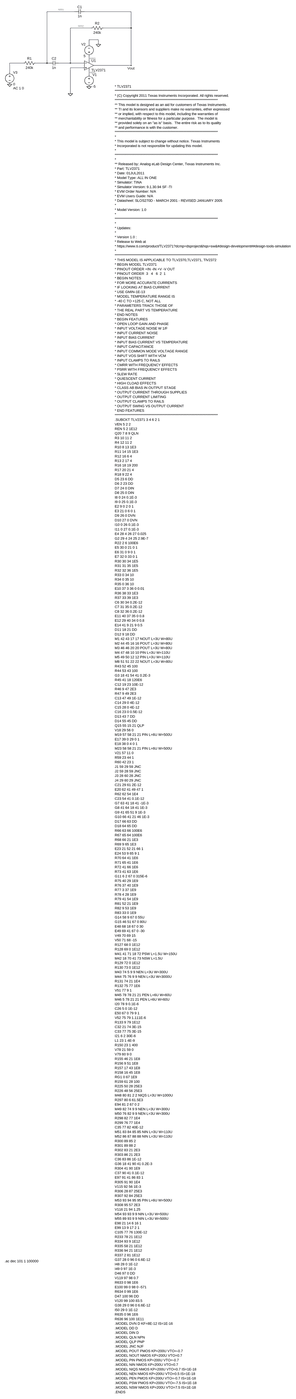
[diagram p0: schematic A.asc, whole sheet]
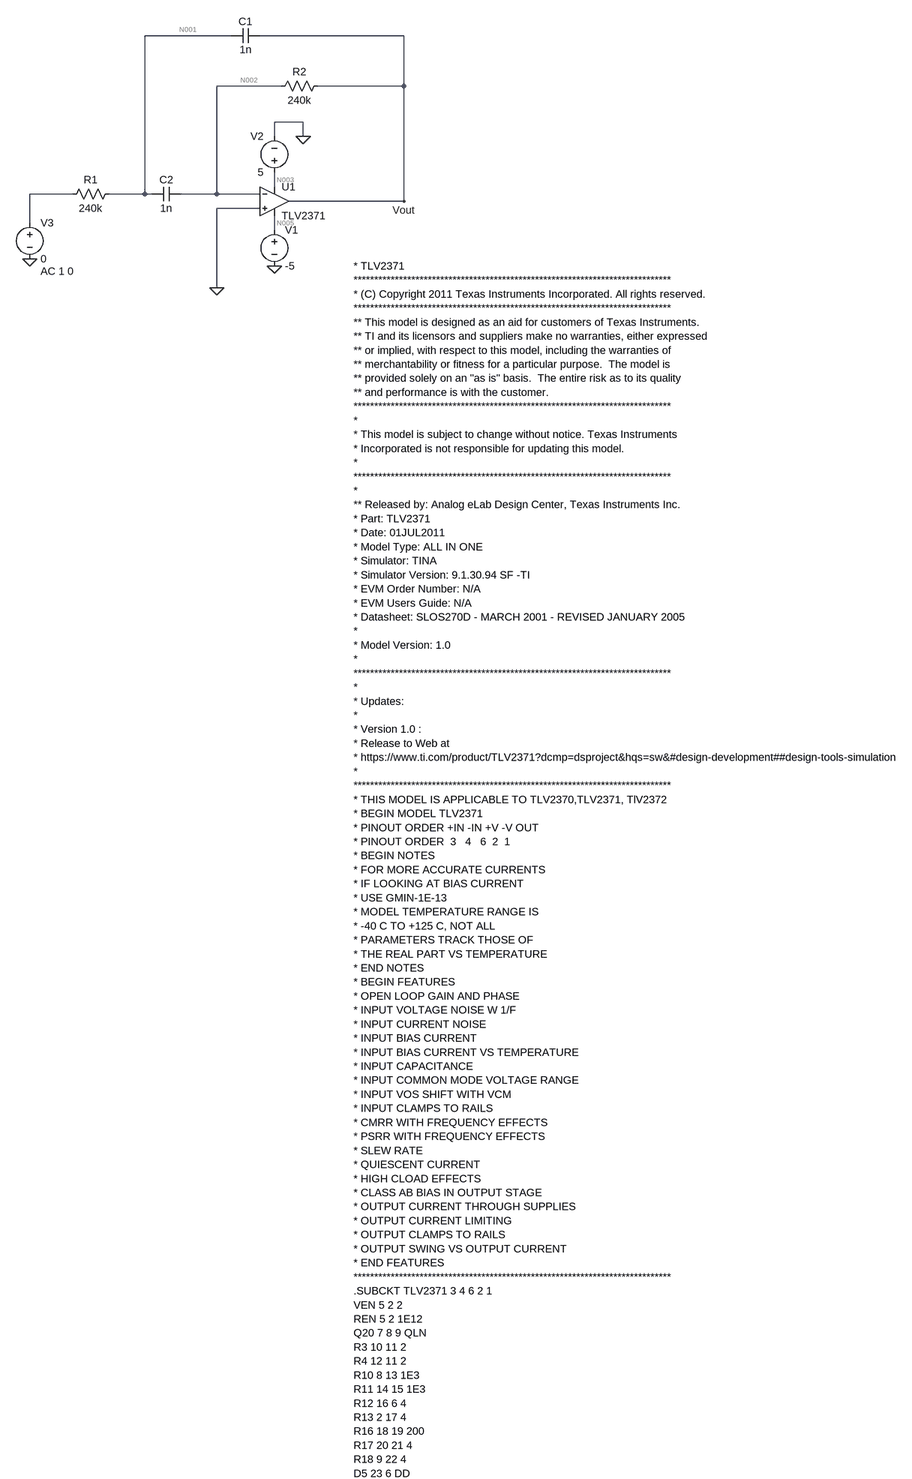
[diagram p1: schematic A.asc, part, row 1 of 3, column 1 of 1]
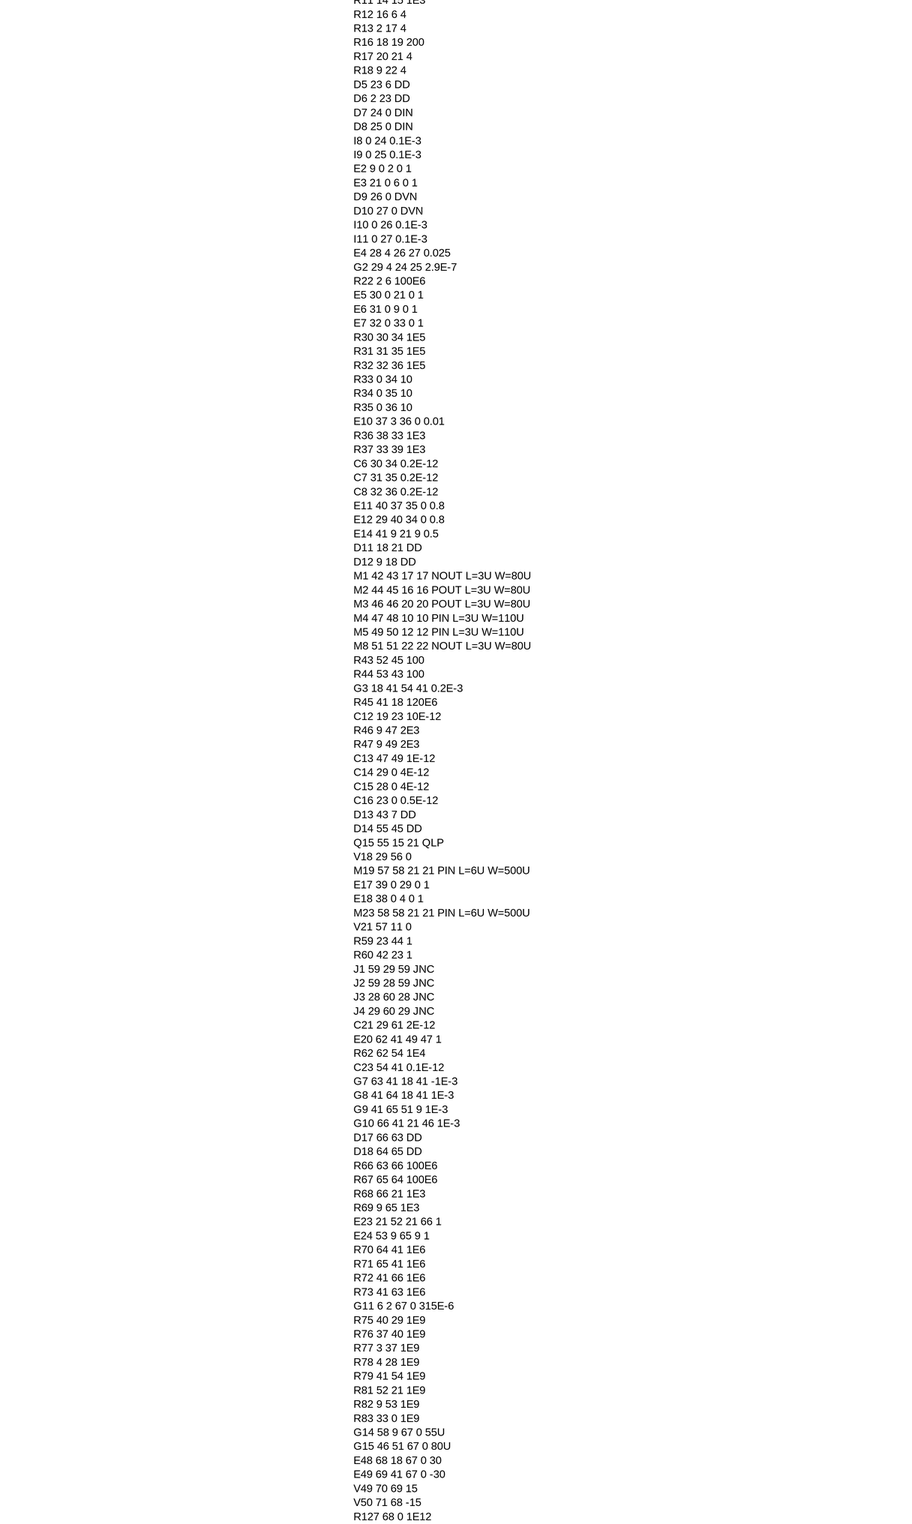
[diagram p2: schematic A.asc, part, row 2 of 3, column 1 of 1]
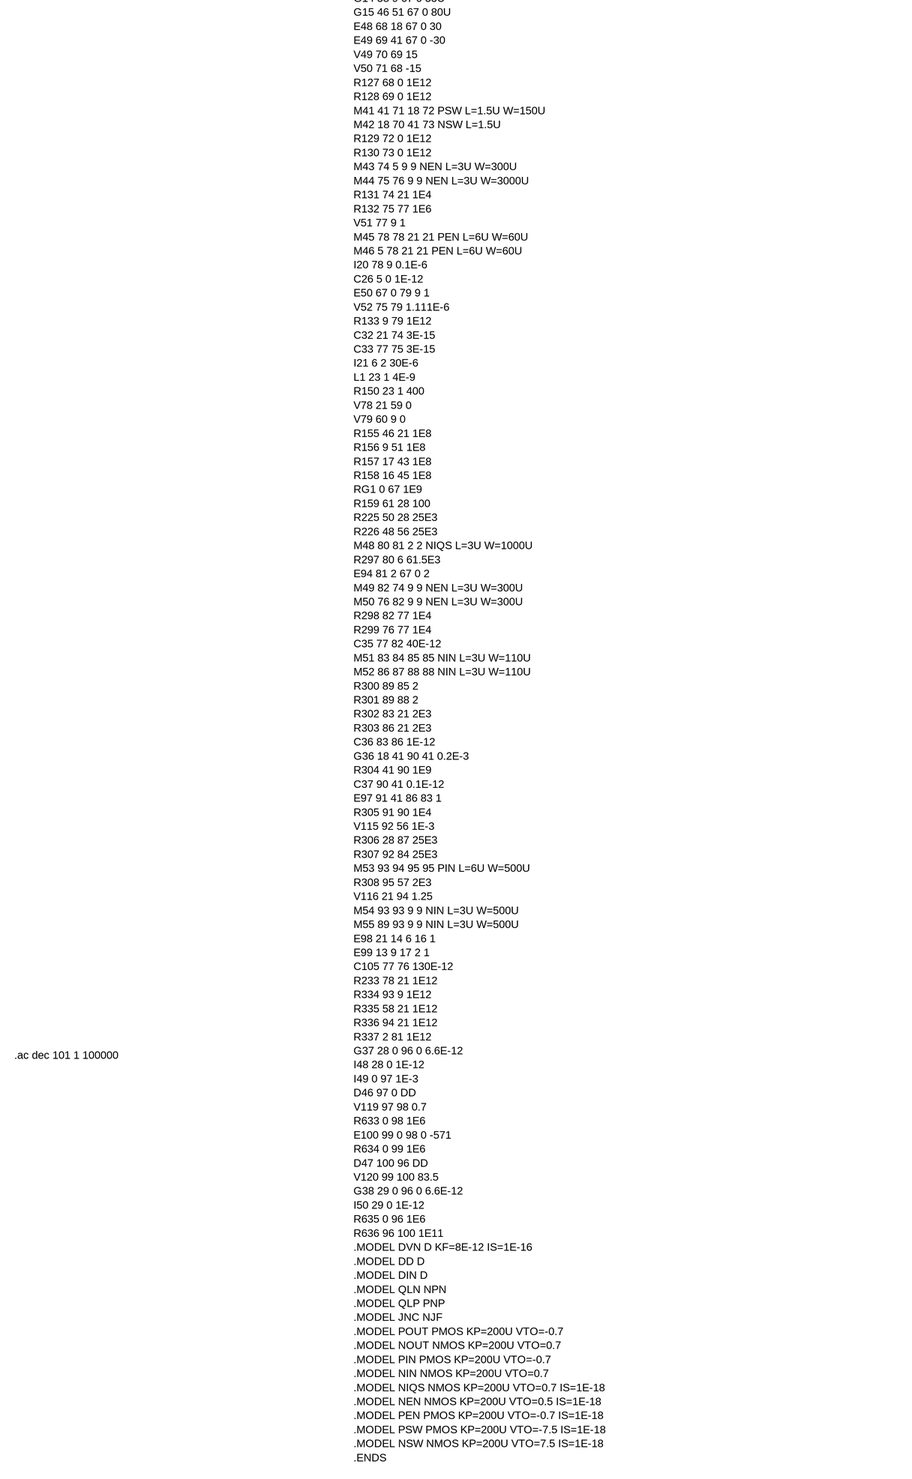
[diagram p3: schematic A.asc, part, row 3 of 3, column 1 of 1]
A.asc, the LTspice schematic file:
Version 4
SHEET 1 1760 8332
WIRE 112 -224 -80 -224
WIRE 496 -224 176 -224
WIRE 224 -112 80 -112
WIRE 496 -112 496 -224
WIRE 496 -112 304 -112
WIRE 272 -32 208 -32
WIRE 208 0 208 -32
WIRE 272 0 272 -32
WIRE 208 112 208 80
WIRE -240 128 -336 128
WIRE -80 128 -80 -224
WIRE -80 128 -160 128
WIRE -64 128 -80 128
WIRE 80 128 80 -112
WIRE 80 128 0 128
WIRE 176 128 80 128
WIRE 496 144 496 -112
WIRE 496 144 240 144
WIRE 176 160 80 160
WIRE -336 192 -336 128
WIRE 208 208 208 176
WIRE 80 336 80 160
FLAG 272 0 0
FLAG 208 288 0
FLAG 80 336 0
FLAG -336 272 0
FLAG 496 144 Vout
SYMBOL OpAmps\\opamp2 208 80 R0
SYMATTR InstName U1
SYMATTR Value TLV2371
SYMBOL res -144 112 R90
WINDOW 0 0 56 VBottom 2
WINDOW 3 32 56 VTop 2
SYMATTR InstName R1
SYMATTR Value 240k
SYMBOL cap 176 -240 R90
WINDOW 0 0 32 VBottom 2
WINDOW 3 32 32 VTop 2
SYMATTR InstName C1
SYMATTR Value 1n
SYMBOL cap 0 112 R90
WINDOW 0 0 32 VBottom 2
WINDOW 3 32 32 VTop 2
SYMATTR InstName C2
SYMATTR Value 1n
SYMBOL res 320 -128 R90
WINDOW 0 0 56 VBottom 2
WINDOW 3 32 56 VTop 2
SYMATTR InstName R2
SYMATTR Value 240k
SYMBOL voltage 208 192 R0
WINDOW 123 0 0 Left 0
WINDOW 39 0 0 Left 0
SYMATTR InstName V1
SYMATTR Value -5
SYMBOL voltage 208 96 R180
WINDOW 0 24 96 Left 2
WINDOW 3 24 16 Left 2
WINDOW 123 0 0 Left 0
WINDOW 39 0 0 Left 0
SYMATTR InstName V2
SYMATTR Value 5
SYMBOL voltage -336 176 R0
WINDOW 123 24 124 Left 2
WINDOW 39 0 0 Left 0
SYMATTR InstName V3
SYMATTR Value 0
SYMATTR Value2 AC 1 0
TEXT 384 288 Left 2 !* TLV2371\n*****************************************************************************\n* (C) Copyright 2011 Texas Instruments Incorporated. All rights reserved.                                            \n*****************************************************************************\n** This model is designed as an aid for customers of Texas Instruments.\n** TI and its licensors and suppliers make no warranties, either expressed\n** or implied, with respect to this model, including the warranties of \n** merchantability or fitness for a particular purpose.  The model is\n** provided solely on an "as is" basis.  The entire risk as to its quality\n** and performance is with the customer.\n*****************************************************************************\n*\n* This model is subject to change without notice. Texas Instruments\n* Incorporated is not responsible for updating this model.\n*\n*****************************************************************************\n*\n** Released by: Analog eLab Design Center, Texas Instruments Inc.\n* Part: TLV2371\n* Date: 01JUL2011\n* Model Type: ALL IN ONE\n* Simulator: TINA\n* Simulator Version: 9.1.30.94 SF -TI\n* EVM Order Number: N/A\n* EVM Users Guide: N/A\n* Datasheet: SLOS270D - MARCH 2001 - REVISED JANUARY 2005\n*\n* Model Version: 1.0\n*\n*****************************************************************************\n*\n* Updates:\n*\n* Version 1.0 : \n* Release to Web at \n* https://www.ti.com/product/TLV2371?dcmp=dsproject&hqs=sw&#design-development##design-tools-simulation\n*\n*****************************************************************************\n* THIS MODEL IS APPLICABLE TO TLV2370,TLV2371, TlV2372\n* BEGIN MODEL TLV2371\n* PINOUT ORDER +IN -IN +V -V OUT\n* PINOUT ORDER  3   4   6  2  1\n* BEGIN NOTES\n* FOR MORE ACCURATE CURRENTS\n* IF LOOKING AT BIAS CURRENT\n* USE GMIN-1E-13\n* MODEL TEMPERATURE RANGE IS\n* -40 C TO +125 C, NOT ALL\n* PARAMETERS TRACK THOSE OF\n* THE REAL PART VS TEMPERATURE\n* END NOTES\n* BEGIN FEATURES\n* OPEN LOOP GAIN AND PHASE\n* INPUT VOLTAGE NOISE W 1/F\n* INPUT CURRENT NOISE\n* INPUT BIAS CURRENT\n* INPUT BIAS CURRENT VS TEMPERATURE\n* INPUT CAPACITANCE\n* INPUT COMMON MODE VOLTAGE RANGE\n* INPUT VOS SHIFT WITH VCM\n* INPUT CLAMPS TO RAILS\n* CMRR WITH FREQUENCY EFFECTS\n* PSRR WITH FREQUENCY EFFECTS\n* SLEW RATE\n* QUIESCENT CURRENT\n* HIGH CLOAD EFFECTS\n* CLASS AB BIAS IN OUTPUT STAGE\n* OUTPUT CURRENT THROUGH SUPPLIES\n* OUTPUT CURRENT LIMITING\n* OUTPUT CLAMPS TO RAILS\n* OUTPUT SWING VS OUTPUT CURRENT\n* END FEATURES\n*****************************************************************************\n.SUBCKT TLV2371 3 4 6 2 1\nVEN 5 2 2\nREN 5 2 1E12\nQ20 7 8 9 QLN\nR3 10 11 2\nR4 12 11 2\nR10 8 13 1E3\nR11 14 15 1E3\nR12 16 6 4\nR13 2 17 4\nR16 18 19 200\nR17 20 21 4\nR18 9 22 4\nD5 23 6 DD\nD6 2 23 DD\nD7 24 0 DIN\nD8 25 0 DIN\nI8 0 24 0.1E-3\nI9 0 25 0.1E-3\nE2 9 0 2 0 1\nE3 21 0 6 0 1\nD9 26 0 DVN\nD10 27 0 DVN\nI10 0 26 0.1E-3\nI11 0 27 0.1E-3\nE4 28 4 26 27 0.025\nG2 29 4 24 25 2.9E-7\nR22 2 6 100E6\nE5 30 0 21 0 1\nE6 31 0 9 0 1\nE7 32 0 33 0 1\nR30 30 34 1E5\nR31 31 35 1E5\nR32 32 36 1E5\nR33 0 34 10\nR34 0 35 10\nR35 0 36 10\nE10 37 3 36 0 0.01\nR36 38 33 1E3\nR37 33 39 1E3\nC6 30 34 0.2E-12\nC7 31 35 0.2E-12\nC8 32 36 0.2E-12\nE11 40 37 35 0 0.8\nE12 29 40 34 0 0.8\nE14 41 9 21 9 0.5\nD11 18 21 DD\nD12 9 18 DD\nM1 42 43 17 17 NOUT L=3U W=80U\nM2 44 45 16 16 POUT L=3U W=80U\nM3 46 46 20 20 POUT L=3U W=80U\nM4 47 48 10 10 PIN L=3U W=110U\nM5 49 50 12 12 PIN L=3U W=110U\nM8 51 51 22 22 NOUT L=3U W=80U\nR43 52 45 100\nR44 53 43 100\nG3 18 41 54 41 0.2E-3\nR45 41 18 120E6\nC12 19 23 10E-12\nR46 9 47 2E3\nR47 9 49 2E3\nC13 47 49 1E-12\nC14 29 0 4E-12\nC15 28 0 4E-12\nC16 23 0 0.5E-12\nD13 43 7 DD\nD14 55 45 DD\nQ15 55 15 21 QLP\nV18 29 56 0\nM19 57 58 21 21 PIN L=6U W=500U\nE17 39 0 29 0 1\nE18 38 0 4 0 1\nM23 58 58 21 21 PIN L=6U W=500U\nV21 57 11 0\nR59 23 44 1\nR60 42 23 1\nJ1 59 29 59 JNC\nJ2 59 28 59 JNC\nJ3 28 60 28 JNC\nJ4 29 60 29 JNC\nC21 29 61 2E-12\nE20 62 41 49 47 1\nR62 62 54 1E4\nC23 54 41 0.1E-12\nG7 63 41 18 41 -1E-3\nG8 41 64 18 41 1E-3\nG9 41 65 51 9 1E-3\nG10 66 41 21 46 1E-3\nD17 66 63 DD\nD18 64 65 DD\nR66 63 66 100E6\nR67 65 64 100E6\nR68 66 21 1E3\nR69 9 65 1E3\nE23 21 52 21 66 1\nE24 53 9 65 9 1\nR70 64 41 1E6\nR71 65 41 1E6\nR72 41 66 1E6\nR73 41 63 1E6\nG11 6 2 67 0 315E-6\nR75 40 29 1E9\nR76 37 40 1E9\nR77 3 37 1E9\nR78 4 28 1E9\nR79 41 54 1E9\nR81 52 21 1E9\nR82 9 53 1E9\nR83 33 0 1E9\nG14 58 9 67 0 55U\nG15 46 51 67 0 80U\nE48 68 18 67 0 30\nE49 69 41 67 0 -30\nV49 70 69 15\nV50 71 68 -15\nR127 68 0 1E12\nR128 69 0 1E12\nM41 41 71 18 72 PSW L=1.5U W=150U\nM42 18 70 41 73 NSW L=1.5U\nR129 72 0 1E12\nR130 73 0 1E12\nM43 74 5 9 9 NEN L=3U W=300U\nM44 75 76 9 9 NEN L=3U W=3000U\nR131 74 21 1E4\nR132 75 77 1E6\nV51 77 9 1\nM45 78 78 21 21 PEN L=6U W=60U\nM46 5 78 21 21 PEN L=6U W=60U\nI20 78 9 0.1E-6\nC26 5 0 1E-12\nE50 67 0 79 9 1\nV52 75 79 1.111E-6\nR133 9 79 1E12\nC32 21 74 3E-15\nC33 77 75 3E-15\nI21 6 2 30E-6\nL1 23 1 4E-9\nR150 23 1 400\nV78 21 59 0\nV79 60 9 0\nR155 46 21 1E8\nR156 9 51 1E8\nR157 17 43 1E8\nR158 16 45 1E8\nRG1 0 67 1E9\nR159 61 28 100\nR225 50 28 25E3\nR226 48 56 25E3\nM48 80 81 2 2 NIQS L=3U W=1000U\nR297 80 6 61.5E3\nE94 81 2 67 0 2\nM49 82 74 9 9 NEN L=3U W=300U\nM50 76 82 9 9 NEN L=3U W=300U\nR298 82 77 1E4\nR299 76 77 1E4\nC35 77 82 40E-12\nM51 83 84 85 85 NIN L=3U W=110U\nM52 86 87 88 88 NIN L=3U W=110U\nR300 89 85 2\nR301 89 88 2\nR302 83 21 2E3\nR303 86 21 2E3\nC36 83 86 1E-12\nG36 18 41 90 41 0.2E-3\nR304 41 90 1E9\nC37 90 41 0.1E-12\nE97 91 41 86 83 1\nR305 91 90 1E4\nV115 92 56 1E-3\nR306 28 87 25E3\nR307 92 84 25E3\nM53 93 94 95 95 PIN L=6U W=500U\nR308 95 57 2E3\nV116 21 94 1.25\nM54 93 93 9 9 NIN L=3U W=500U\nM55 89 93 9 9 NIN L=3U W=500U\nE98 21 14 6 16 1\nE99 13 9 17 2 1\nC105 77 76 130E-12\nR233 78 21 1E12\nR334 93 9 1E12\nR335 58 21 1E12\nR336 94 21 1E12\nR337 2 81 1E12\nG37 28 0 96 0 6.6E-12\nI48 28 0 1E-12\nI49 0 97 1E-3\nD46 97 0 DD\nV119 97 98 0.7\nR633 0 98 1E6\nE100 99 0 98 0 -571\nR634 0 99 1E6\nD47 100 96 DD\nV120 99 100 83.5\nG38 29 0 96 0 6.6E-12\nI50 29 0 1E-12\nR635 0 96 1E6\nR636 96 100 1E11\n.MODEL DVN D KF=8E-12 IS=1E-16\n.MODEL DD D\n.MODEL DIN D\n.MODEL QLN NPN\n.MODEL QLP PNP\n.MODEL JNC NJF\n.MODEL POUT PMOS KP=200U VTO=-0.7\n.MODEL NOUT NMOS KP=200U VTO=0.7\n.MODEL PIN PMOS KP=200U VTO=-0.7\n.MODEL NIN NMOS KP=200U VTO=0.7\n.MODEL NIQS NMOS KP=200U VTO=0.7 IS=1E-18\n.MODEL NEN NMOS KP=200U VTO=0.5 IS=1E-18\n.MODEL PEN PMOS KP=200U VTO=-0.7 IS=1E-18\n.MODEL PSW PMOS KP=200U VTO=-7.5 IS=1E-18\n.MODEL NSW NMOS KP=200U VTO=7.5 IS=1E-18\n.ENDS
TEXT -370 8316 Left 2 !.ac dec 101 1 100000

The netlist it stands for:
* A.asc
XU1 0 N002 N003 N005 Vout TLV2371  ; pins In+ In- V+ V- OUT
R1 N001 N004 240k
C1 Vout N001 1n
C2 N002 N001 1n
R2 Vout N002 240k
V1 N005 0 -5
V2 N003 0 5
V3 N004 0 0 AC 1 0
* TLV2371
*****************************************************************************
* (C) Copyright 2011 Texas Instruments Incorporated. All rights reserved.
*****************************************************************************
** This model is designed as an aid for customers of Texas Instruments.
** TI and its licensors and suppliers make no warranties, either expressed
** or implied, with respect to this model, including the warranties of
** merchantability or fitness for a particular purpose.  The model is
** provided solely on an "as is" basis.  The entire risk as to its quality
** and performance is with the customer.
*****************************************************************************
*
* This model is subject to change without notice. Texas Instruments
* Incorporated is not responsible for updating this model.
*
*****************************************************************************
*
** Released by: Analog eLab Design Center, Texas Instruments Inc.
* Part: TLV2371
* Date: 01JUL2011
* Model Type: ALL IN ONE
* Simulator: TINA
* Simulator Version: 9.1.30.94 SF -TI
* EVM Order Number: N/A
* EVM Users Guide: N/A
* Datasheet: SLOS270D - MARCH 2001 - REVISED JANUARY 2005
*
* Model Version: 1.0
*
*****************************************************************************
*
* Updates:
*
* Version 1.0 :
* Release to Web at
* https://www.ti.com/product/TLV2371?dcmp=dsproject&hqs=sw&#design-development##design-tools-simulation
*
*****************************************************************************
* THIS MODEL IS APPLICABLE TO TLV2370,TLV2371, TlV2372
* BEGIN MODEL TLV2371
* PINOUT ORDER +IN -IN +V -V OUT
* PINOUT ORDER  3   4   6  2  1
* BEGIN NOTES
* FOR MORE ACCURATE CURRENTS
* IF LOOKING AT BIAS CURRENT
* USE GMIN-1E-13
* MODEL TEMPERATURE RANGE IS
* -40 C TO +125 C, NOT ALL
* PARAMETERS TRACK THOSE OF
* THE REAL PART VS TEMPERATURE
* END NOTES
* BEGIN FEATURES
* OPEN LOOP GAIN AND PHASE
* INPUT VOLTAGE NOISE W 1/F
* INPUT CURRENT NOISE
* INPUT BIAS CURRENT
* INPUT BIAS CURRENT VS TEMPERATURE
* INPUT CAPACITANCE
* INPUT COMMON MODE VOLTAGE RANGE
* INPUT VOS SHIFT WITH VCM
* INPUT CLAMPS TO RAILS
* CMRR WITH FREQUENCY EFFECTS
* PSRR WITH FREQUENCY EFFECTS
* SLEW RATE
* QUIESCENT CURRENT
* HIGH CLOAD EFFECTS
* CLASS AB BIAS IN OUTPUT STAGE
* OUTPUT CURRENT THROUGH SUPPLIES
* OUTPUT CURRENT LIMITING
* OUTPUT CLAMPS TO RAILS
* OUTPUT SWING VS OUTPUT CURRENT
* END FEATURES
*****************************************************************************
.SUBCKT TLV2371 3 4 6 2 1
VEN 5 2 2
REN 5 2 1E12
Q20 7 8 9 QLN
R3 10 11 2
R4 12 11 2
R10 8 13 1E3
R11 14 15 1E3
R12 16 6 4
R13 2 17 4
R16 18 19 200
R17 20 21 4
R18 9 22 4
D5 23 6 DD
D6 2 23 DD
D7 24 0 DIN
D8 25 0 DIN
I8 0 24 0.1E-3
I9 0 25 0.1E-3
E2 9 0 2 0 1
E3 21 0 6 0 1
D9 26 0 DVN
D10 27 0 DVN
I10 0 26 0.1E-3
I11 0 27 0.1E-3
E4 28 4 26 27 0.025
G2 29 4 24 25 2.9E-7
R22 2 6 100E6
E5 30 0 21 0 1
E6 31 0 9 0 1
E7 32 0 33 0 1
R30 30 34 1E5
R31 31 35 1E5
R32 32 36 1E5
R33 0 34 10
R34 0 35 10
R35 0 36 10
E10 37 3 36 0 0.01
R36 38 33 1E3
R37 33 39 1E3
C6 30 34 0.2E-12
C7 31 35 0.2E-12
C8 32 36 0.2E-12
E11 40 37 35 0 0.8
E12 29 40 34 0 0.8
E14 41 9 21 9 0.5
D11 18 21 DD
D12 9 18 DD
M1 42 43 17 17 NOUT L=3U W=80U
M2 44 45 16 16 POUT L=3U W=80U
M3 46 46 20 20 POUT L=3U W=80U
M4 47 48 10 10 PIN L=3U W=110U
M5 49 50 12 12 PIN L=3U W=110U
M8 51 51 22 22 NOUT L=3U W=80U
R43 52 45 100
R44 53 43 100
G3 18 41 54 41 0.2E-3
R45 41 18 120E6
C12 19 23 10E-12
R46 9 47 2E3
R47 9 49 2E3
C13 47 49 1E-12
C14 29 0 4E-12
C15 28 0 4E-12
C16 23 0 0.5E-12
D13 43 7 DD
D14 55 45 DD
Q15 55 15 21 QLP
V18 29 56 0
M19 57 58 21 21 PIN L=6U W=500U
E17 39 0 29 0 1
E18 38 0 4 0 1
M23 58 58 21 21 PIN L=6U W=500U
V21 57 11 0
R59 23 44 1
R60 42 23 1
J1 59 29 59 JNC
J2 59 28 59 JNC
J3 28 60 28 JNC
J4 29 60 29 JNC
C21 29 61 2E-12
E20 62 41 49 47 1
R62 62 54 1E4
C23 54 41 0.1E-12
G7 63 41 18 41 -1E-3
G8 41 64 18 41 1E-3
G9 41 65 51 9 1E-3
G10 66 41 21 46 1E-3
D17 66 63 DD
D18 64 65 DD
R66 63 66 100E6
R67 65 64 100E6
R68 66 21 1E3
R69 9 65 1E3
E23 21 52 21 66 1
E24 53 9 65 9 1
R70 64 41 1E6
R71 65 41 1E6
R72 41 66 1E6
R73 41 63 1E6
G11 6 2 67 0 315E-6
R75 40 29 1E9
R76 37 40 1E9
R77 3 37 1E9
R78 4 28 1E9
R79 41 54 1E9
R81 52 21 1E9
R82 9 53 1E9
R83 33 0 1E9
G14 58 9 67 0 55U
G15 46 51 67 0 80U
E48 68 18 67 0 30
E49 69 41 67 0 -30
V49 70 69 15
V50 71 68 -15
R127 68 0 1E12
R128 69 0 1E12
M41 41 71 18 72 PSW L=1.5U W=150U
M42 18 70 41 73 NSW L=1.5U
R129 72 0 1E12
R130 73 0 1E12
M43 74 5 9 9 NEN L=3U W=300U
M44 75 76 9 9 NEN L=3U W=3000U
R131 74 21 1E4
R132 75 77 1E6
V51 77 9 1
M45 78 78 21 21 PEN L=6U W=60U
M46 5 78 21 21 PEN L=6U W=60U
I20 78 9 0.1E-6
C26 5 0 1E-12
E50 67 0 79 9 1
V52 75 79 1.111E-6
R133 9 79 1E12
C32 21 74 3E-15
C33 77 75 3E-15
I21 6 2 30E-6
L1 23 1 4E-9
R150 23 1 400
V78 21 59 0
V79 60 9 0
R155 46 21 1E8
R156 9 51 1E8
R157 17 43 1E8
R158 16 45 1E8
RG1 0 67 1E9
R159 61 28 100
R225 50 28 25E3
R226 48 56 25E3
M48 80 81 2 2 NIQS L=3U W=1000U
R297 80 6 61.5E3
E94 81 2 67 0 2
M49 82 74 9 9 NEN L=3U W=300U
M50 76 82 9 9 NEN L=3U W=300U
R298 82 77 1E4
R299 76 77 1E4
C35 77 82 40E-12
M51 83 84 85 85 NIN L=3U W=110U
M52 86 87 88 88 NIN L=3U W=110U
R300 89 85 2
R301 89 88 2
R302 83 21 2E3
R303 86 21 2E3
C36 83 86 1E-12
G36 18 41 90 41 0.2E-3
R304 41 90 1E9
C37 90 41 0.1E-12
E97 91 41 86 83 1
R305 91 90 1E4
V115 92 56 1E-3
R306 28 87 25E3
R307 92 84 25E3
M53 93 94 95 95 PIN L=6U W=500U
R308 95 57 2E3
V116 21 94 1.25
M54 93 93 9 9 NIN L=3U W=500U
M55 89 93 9 9 NIN L=3U W=500U
E98 21 14 6 16 1
E99 13 9 17 2 1
C105 77 76 130E-12
R233 78 21 1E12
R334 93 9 1E12
R335 58 21 1E12
R336 94 21 1E12
R337 2 81 1E12
G37 28 0 96 0 6.6E-12
I48 28 0 1E-12
I49 0 97 1E-3
D46 97 0 DD
V119 97 98 0.7
R633 0 98 1E6
E100 99 0 98 0 -571
R634 0 99 1E6
D47 100 96 DD
V120 99 100 83.5
G38 29 0 96 0 6.6E-12
I50 29 0 1E-12
R635 0 96 1E6
R636 96 100 1E11
.MODEL DVN D KF=8E-12 IS=1E-16
.MODEL DD D
.MODEL DIN D
.MODEL QLN NPN
.MODEL QLP PNP
.MODEL JNC NJF
.MODEL POUT PMOS KP=200U VTO=-0.7
.MODEL NOUT NMOS KP=200U VTO=0.7
.MODEL PIN PMOS KP=200U VTO=-0.7
.MODEL NIN NMOS KP=200U VTO=0.7
.MODEL NIQS NMOS KP=200U VTO=0.7 IS=1E-18
.MODEL NEN NMOS KP=200U VTO=0.5 IS=1E-18
.MODEL PEN PMOS KP=200U VTO=-0.7 IS=1E-18
.MODEL PSW PMOS KP=200U VTO=-7.5 IS=1E-18
.MODEL NSW NMOS KP=200U VTO=7.5 IS=1E-18
.ENDS
.ac dec 101 1 100000
.backanno
.end

* Results of the author's LTspice run, read from the files saved beside the schematic
* Operating Point, zero values left out:
*   V(n005) = -5 V
*   V(n003) = 5 V
*   V(n002) = 118.2 nV
*   V(vout) = 357.2 nV
*   I(V2) = -594.9 µA
*   I(V1) = 595 µA
*   Ix(u1:6) = 594.9 µA
*   Ix(u1:2) = -595 µA
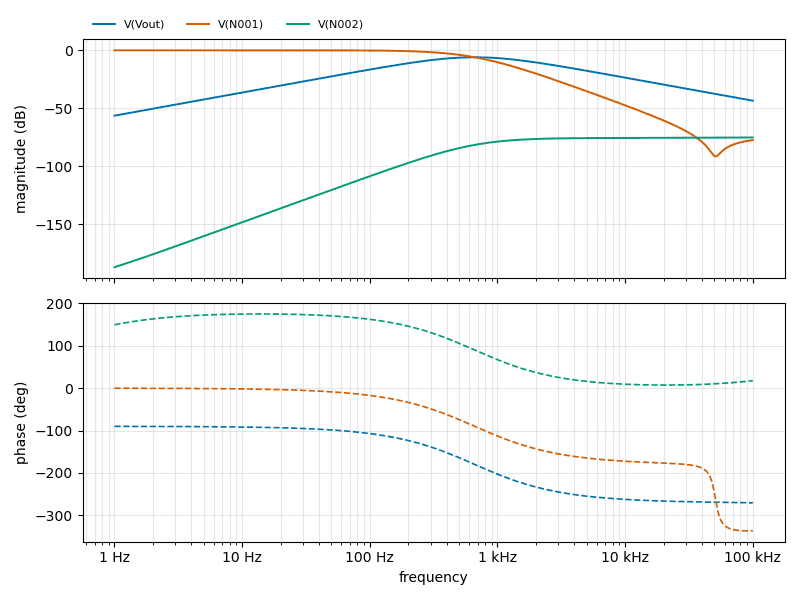
[diagram p4: AC Analysis of A.asc, plotted from the saved traces]
* AC Analysis, 1 run:
*   V(Vout): -56.43 dB at 1 Hz, -43.50 dB at 100 kHz, peak -6.02 dB at 663.4 Hz, 3 dB below the peak at 274.7 Hz and 1.601 kHz
*   V(N001): -0.00 dB at 1 Hz, -77.51 dB at 100 kHz, peak -0.00 dB at 1 Hz, 3 dB below the peak at 426.7 Hz
*   V(N002): -187.26 dB at 1 Hz, -75.21 dB at 100 kHz, peak -75.21 dB at 100 kHz, 3 dB below the peak at 1.131 kHz